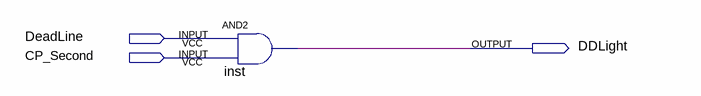
[diagram p0: schematic sheet]
// Quartus schematic DDLight.bdf as structural Verilog: 1 symbols, 3 pins
module DDLight (
  input  DeadLine,
  input  CP_Second,
  output DDLight
);

  and inst (DDLight, DeadLine, CP_Second);
endmodule
